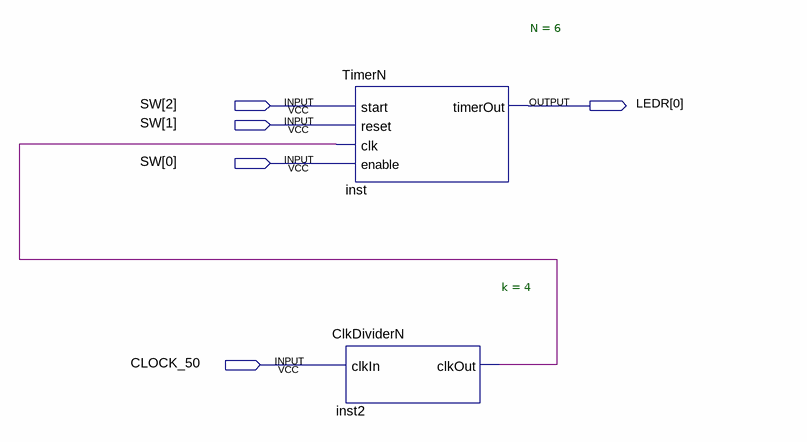
[diagram p0: schematic sheet]
// Quartus schematic TimerN_Demo.bdf as structural Verilog: 2 symbols, 5 pins
module TimerN_Demo (
  input  [2:0] SW,
  input  CLOCK_50,
  output [0:0] LEDR
);

  wire inst2_clkout;

  TimerN #(.N(6)) inst (.start(SW[2]), .reset(SW[1]), .clk(inst2_clkout), .enable(SW[0]), .timerOut(LEDR[0]));
  ClkDividerN #(.k(4)) inst2 (.clkIn(CLOCK_50), .clkOut(inst2_clkout));
endmodule
